# EAGLE design vp 2019-11b (EAGLE 9.3.0)
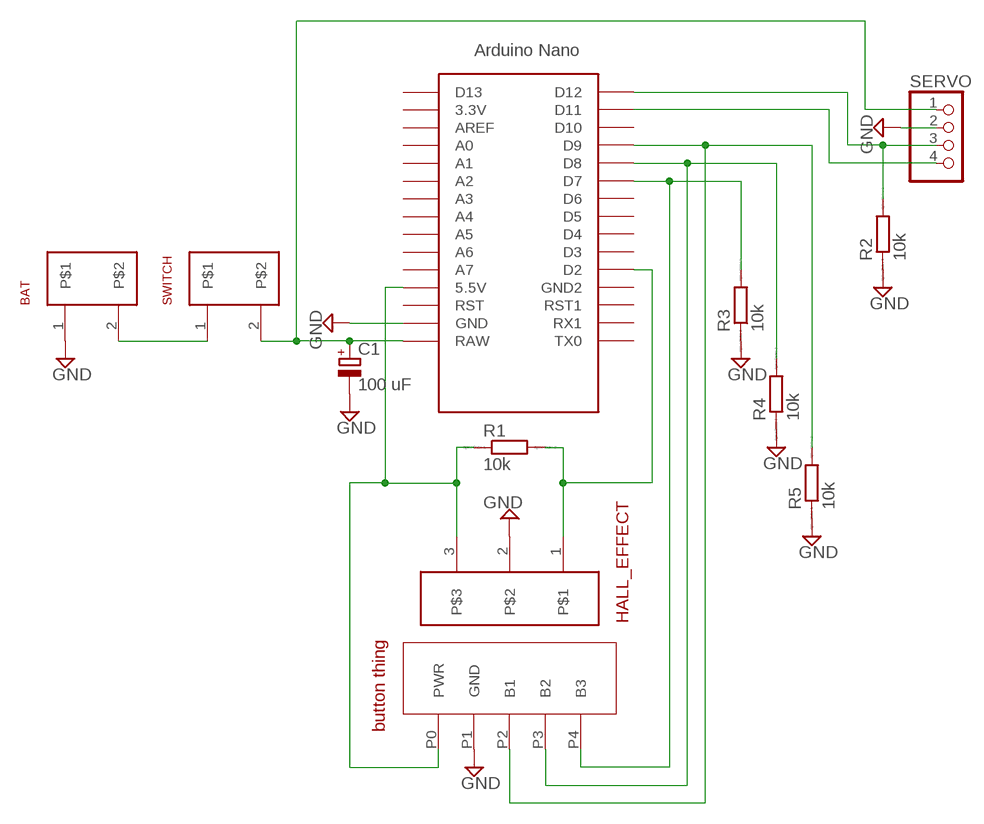
[diagram p0: schematic, sheet 1]

## Parts
BAT  TERMINAL_2POS  [TERMINAL_2POS]
BUTTON  BUTTON_CRAP  [5PIN]
C1  100 uF  CPOL-EUE2-5  [E2-5]
HALL_EFFECT  TERMINAL_3POS  [TERMINAL_3POS]
R1  10k  RR0603  [R0603]
R2  10k  RR0603  [R0603]
R3  10k  RR0603  [R0603]
R4  10k  RR0603  [R0603]
R5  10k  RR0603  [R0603]
SERVO  PINHD-1X4  [1X04]
SWITCH  TERMINAL_2POS  [TERMINAL_2POS]
U$1  NANO  [NANO]

## Nets
GND: BAT.1 BUTTON.P1(GND) C1.- HALL_EFFECT.2 R2.1 R3.1 R4.1 R5.1 SERVO.2 U$1.GND
N$1: R2.2 SERVO.3 U$1.D12
N$2: SERVO.4 U$1.D11
N$3: C1.+ SERVO.1 SWITCH.2 U$1.RAW
N$4: BUTTON.P0(PWR) HALL_EFFECT.3 R1.1 U$1.5V(5.5V)
N$5: BAT.2 SWITCH.1
N$6: HALL_EFFECT.1 R1.2 U$1.D2
N$8: BUTTON.P4(B3) R3.2 U$1.D7
N$10: BUTTON.P3(B2) R4.2 U$1.D8
N$11: BUTTON.P2(B1) R5.2 U$1.D9
Unconnected: U$1.3.3V U$1.A0 U$1.A1 U$1.A2 U$1.A3 U$1.A4 U$1.A5 U$1.A6 U$1.A7 U$1.AREF U$1.D3 U$1.D4 U$1.D5 U$1.D6 U$1.D10 U$1.D13 U$1.GND1(GND2) U$1.ICSP1 U$1.ICSP2 U$1.ICSP3 U$1.ICSP4 U$1.ICSP5 U$1.ICSP6 U$1.RST U$1.RST1 U$1.RX1 U$1.TX0

## Library data of the parts
BAT SWITCH = Variable Pitch:TERMINAL_2POS
BUTTON = Variable Pitch:BUTTON_CRAP
C1 = rcl:CPOL-EU: POLARIZED CAPACITOR, European symbol; SPICEPREFIX: C
HALL_EFFECT = Variable Pitch:TERMINAL_3POS
R1-R5 = eagle-ltspice:R: RESISTOR, European symbol; SPICEMODEL: NONE; SPICEPREFIX: R
SERVO = pinhead:PINHD-1X4: PIN HEADER
U$1 = Arduino-clone:NANO: Arduino Nano

## Board
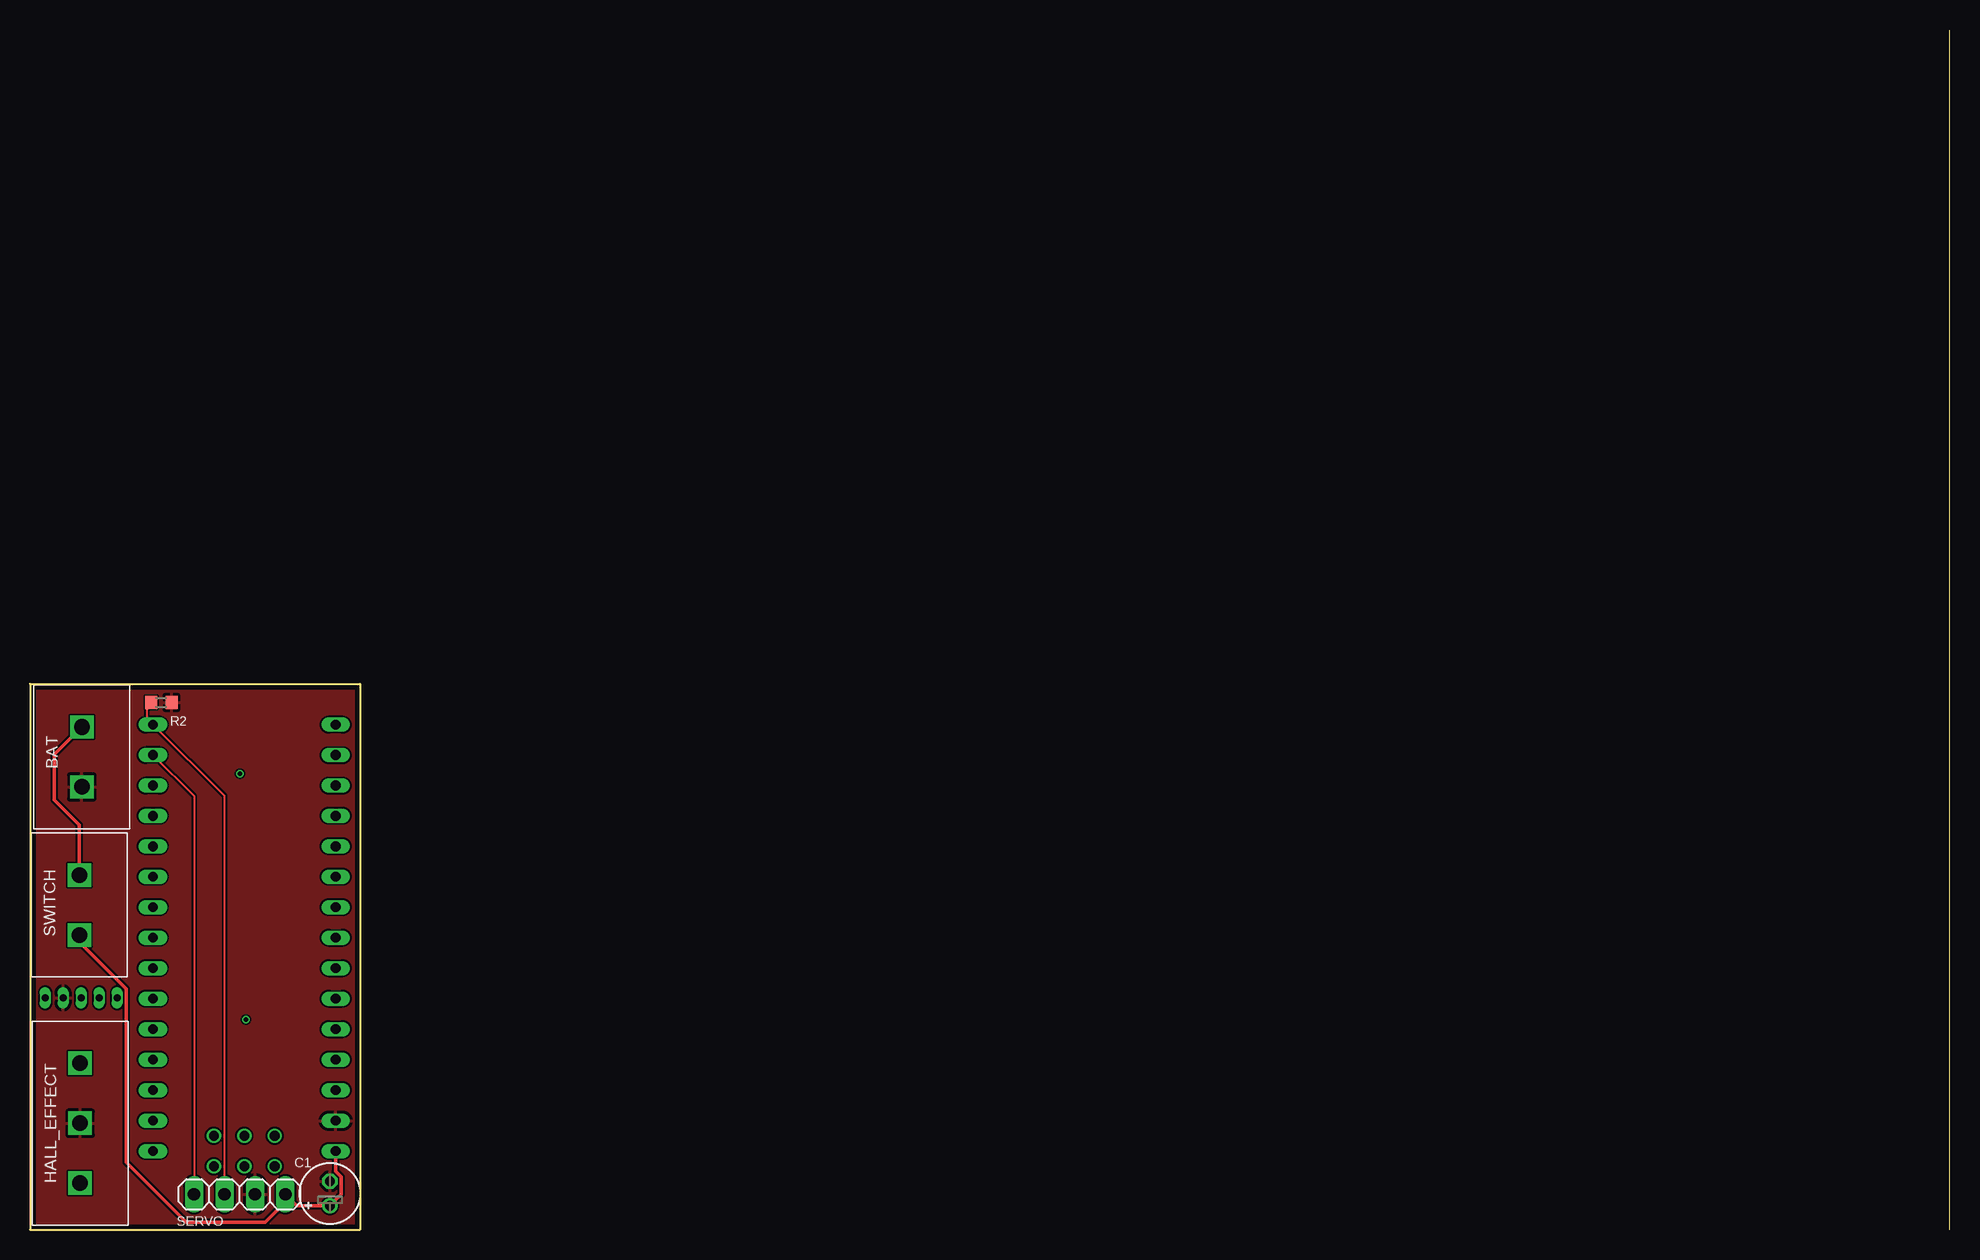
[diagram p1: board, top side]
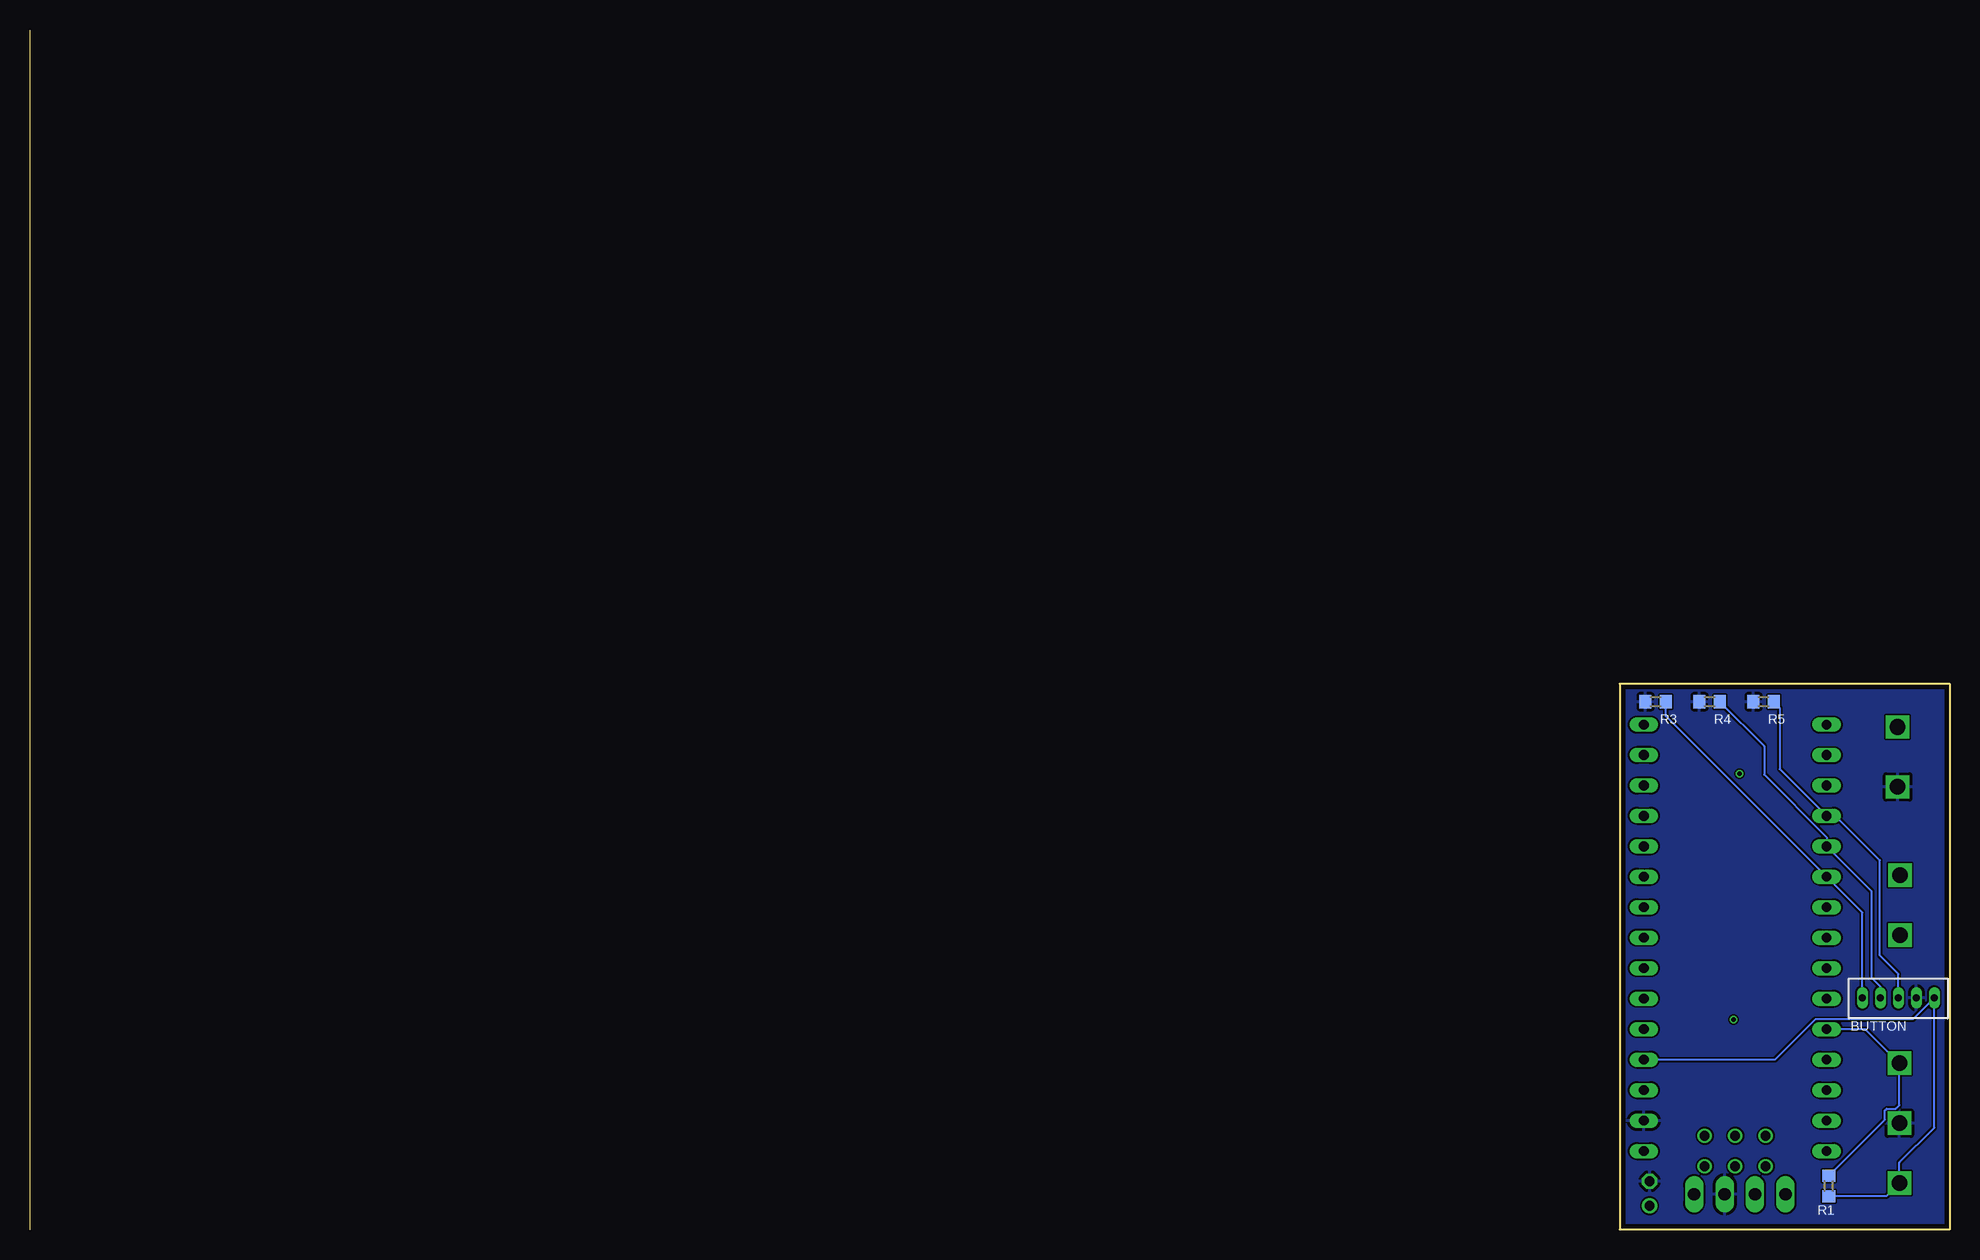
[diagram p2: board, bottom side, seen from below]

Size 160 x 100 mm. Coordinates in mm from the lower left corner, seen from the top.
Outline: 160,0 160,100
Outline: 0,45.5 27.5,45.5 27.5,0 0,0 0,45.5
Copper layers (1*16): Top 0.035559375mm / dielectric 1.6mm / Bottom 0.035559375mm
Design rules "oshpark-2layer": minimum track width 6mil, minimum drill 10mil, track to track 6mil, track to pad 6mil, pad to pad 6mil, via to via 6mil, smd to smd 6mil, copper to edge 15mil, drill to drill 6mil, minimum pad ring 5mil, minimum via ring 5mil, stop-mask expansion 2.5mil, vias tented up to drill 0mil, thermal gap 10mil

### Footprints (pad centres in the part's own frame; a part is rotated, then mirrored left to right if it is on the bottom)
TERMINAL_2POS = drill 1.3 square: 1 -2.5,0; 2 2.5,0
5PIN = drill 0.6 long: P0 0.19,2.23; P1 0.19,0.73; P2 0.19,-0.77; P3 0.19,-2.27; P4 0.19,-3.77
E2-5 = drill 0.813 pad 1.27: + -1.016,0 | drill 0.813 pad 1.27 octagon: - 1.016,0
TERMINAL_3POS = drill 1.3 square: 1 -5,0; 2 0,0; 3 5,0
R0603 = smd 1 x 1.1: 1 -0.85,0; 2 0.85,0
1X04 = drill 1.016 long: 1 -3.81,0; 2 -1.27,0; 3 1.27,0; 4 3.81,0
NANO = drill 0.8 long: 3.3V -10.16,24.13; 5V -10.16,-1.27; A0 -10.16,19.05; A1 -10.16,16.51; A2 -10.16,13.97; A3 -10.16,11.43; A4 -10.16,8.89; A5 -10.16,6.35; A6 -10.16,3.81; A7 -10.16,1.27; AREF -10.16,21.59; D2 5.08,1.27; D3 5.08,3.81; D4 5.08,6.35; D5 5.08,8.89; D6 5.08,11.43; D7 5.08,13.97; D8 5.08,16.51; D9 5.08,19.05; D10 5.08,21.59; D11 5.08,24.13; D12 5.08,26.67; D13 -10.16,26.67; GND -10.16,-6.35; GND1 5.08,-1.27; RAW -10.16,-8.89; RST -10.16,-3.81; RST1 5.08,-3.81; RX1 5.08,-6.35; TX0 5.08,-8.89 | drill 0.8: ICSP1 -5.08,-10.16; ICSP2 -5.08,-7.62; ICSP3 -2.54,-10.16; ICSP4 -2.54,-7.62; ICSP5 0,-10.16; ICSP6 0,-7.62

### Placement (x,y rotation side)
BAT  4.32,39.4 90 top
BUTTON  3.5,19.5 270 bottom
C1  25,3 90 top
HALL_EFFECT  4.18,8.86 270 top
R1  10.07,3.63 90 bottom
R2  10.95,43.93 180 top
R3  24.5,44 0 bottom
R4  20,44 0 bottom
R5  15.5,44 0 bottom
SERVO  17.48,2.93 180 top
SWITCH  4.11,27.05 270 top
U$1  15.32,15.43 0 bottom

### Tracks (layer width: path | path; a pad name or v marks a point on that pad's centre or on a via)
GND
  pour Top: -0.5,47.5 30.5,47.5 30.5,-1 -1.5,-1 -1.5,46.5
  pour Bottom: -1,46 32.5,46 32.5,-3.5 0,-3.5 -3,-0.5 -3,44
N$1
  Top 0.152: R2.2 9.74,43.57 9.74,42.6 U$1.D12 16.21,36.13 SERVO.3
N$2
  Top 0.152: U$1.D11 13.67,36.13 SERVO.4
N$3
  Top 0.305: U$1.RAW 25.48,4.87 25.94,4.41 25.94,2.92 C1.+ 22.24,1.98 SERVO.1 21.29,2.29 19.61,0.61 13,0.61 8.03,5.58 8.03,20.07 4.11,23.99 SWITCH.2
N$4
  Bottom 0.152: U$1.5V 14.55,14.16 11.18,17.53 3.05,17.53 BUTTON.P0 1.27,8.5 4.18,5.59 HALL_EFFECT.3 5.26,2.78 R1.1
N$5
  Top 0.305: SWITCH.1 4.11,33.73 2.04,35.8 2.04,39.62 BAT.2
N$6
  Bottom 0.152: R1.2 5.38,9.17 5.38,9.93 5.25,10.06 4.49,10.06 4.18,10.37 HALL_EFFECT.1 7.02,16.7 U$1.D2
N$7  (via drill 0.35)
  other vias: 17.5,38
N$8
  Bottom 0.152: BUTTON.P4 7.27,26.43 U$1.D7 23.65,42.81 R3.2
N$9  (via drill 0.35)
  other vias: 18,17.5
N$10
  Bottom 0.152: BUTTON.P3 5.77,20.27 6.5,21 6.5,28.2 U$1.D8 10.24,32.71 15.46,37.92 15.46,40.3 R4.2
N$11
  Bottom 0.152: BUTTON.P2 4.27,21.31 5.81,22.85 5.81,30.78 9.51,34.48 U$1.D9 14.15,38.39 14.15,43.5 R5.2